# Altium schematic sheet Industrial-Controller_MCU.SchDoc: MCU
size 279 x 215 mm; Date: not used; ApprovedBy: not used; CheckedBy: not used; Author: not used; DrawnBy: not used; Organization: not used; Address4: not used; SheetNumber: 3; SheetTotal: 21; Time: not used; ImagePath: not used; Application_BuildNumber: not used
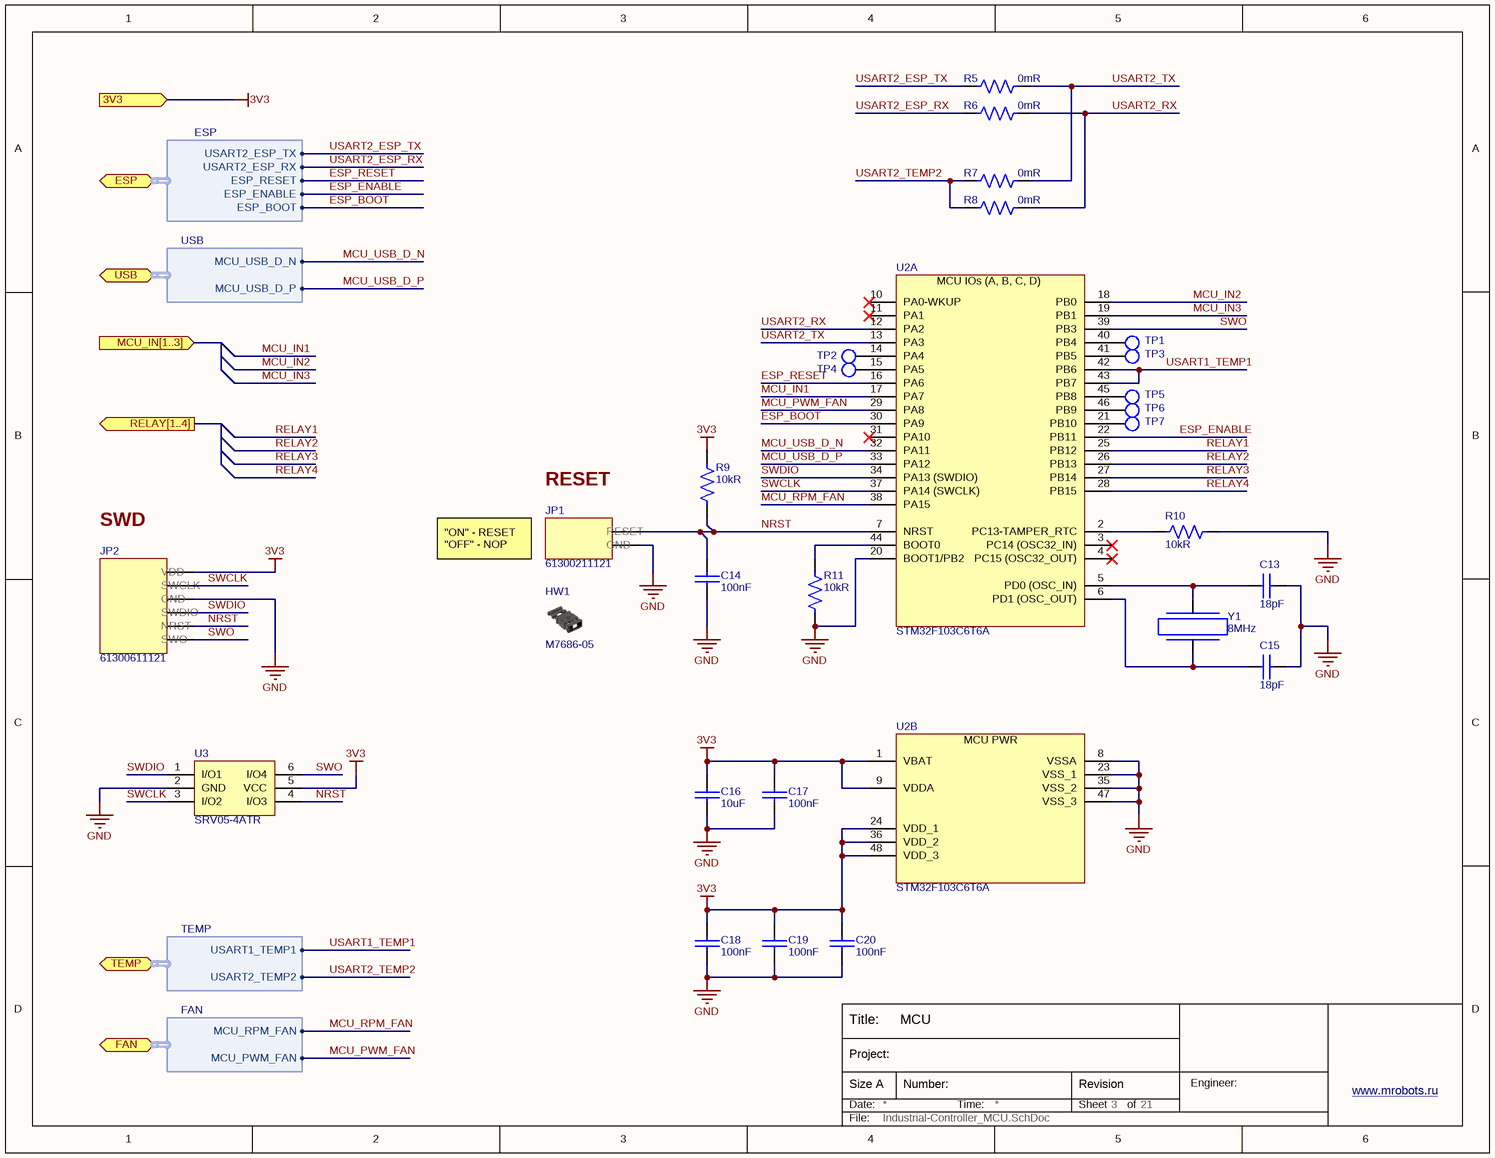
[diagram p0: Industrial-Controller_MCU.SchDoc]

## Parts
C13  18pF  [CAP_0603]
C14  100nF  [CAP_0603]
C15  18pF  [CAP_0603]
C16  10uF  [CAP_1210]
C17  100nF  [CAP_0603]
C18  100nF  [CAP_0603]
C19  100nF  [CAP_0603]
C20  100nF  [CAP_0603]
HW1  M7686-05  (mechanical)
JP1  61300211121  [PLS-2]
JP2  61300611121  [PLS-6]
R5  0mR  [RES_0603]
R6  0mR  [RES_0603]
R7  0mR  [RES_0603]
R8  0mR  [RES_0603]
R9  10kR  [RES_0603]
R10  10kR  [RES_0603]
R11  10kR  [RES_0603]
TP1  TEST_POINT_SMT  [TEST_POINT_SMT]  (value not drawn)  (no BOM)
TP2  TEST_POINT_SMT  [TEST_POINT_SMT]  (value not drawn)  (no BOM)
TP3  TEST_POINT_SMT  [TEST_POINT_SMT]  (value not drawn)  (no BOM)
TP4  TEST_POINT_SMT  [TEST_POINT_SMT]  (value not drawn)  (no BOM)
TP5  TEST_POINT_SMT  [TEST_POINT_SMT]  (value not drawn)  (no BOM)
TP6  TEST_POINT_SMT  [TEST_POINT_SMT]  (value not drawn)  (no BOM)
TP7  TEST_POINT_SMT  [TEST_POINT_SMT]  (value not drawn)  (no BOM)
U2  STM32F103C6T6A  [LQFP48]  (parts A,B of 2)
U3  SRV05-4ATR  [SOT-23-6]
Y1  8MHz  [HC-49/US]

## Ports
3V3 (in), ESP (bidir, harness ESP), FAN (bidir, harness FAN), MCU_IN[1..3] (in), RELAY[1..4] (out), TEMP (bidir, harness TEMP), USB (bidir, harness USB)

## Harnesses
ESP: USART2_ESP_TX, USART2_ESP_RX, ESP_RESET, ESP_ENABLE, ESP_BOOT
USB: MCU_USB_D_N, MCU_USB_D_P
FAN: MCU_RPM_FAN, MCU_PWM_FAN
TEMP: USART1_TEMP1, USART2_TEMP2

## Nets
3V3: C16.2 C17.1 C18.1 C19.1 C20.1 JP2.1 R9.1 U2.1(VBAT) U2.9(VDDA) U2.24(VDD_1) U2.36(VDD_2) U2.48(VDD_3) U3.5(VCC) ; port 3V3
GND: C13.2 C14.2 C15.2 C16.1 C17.2 C18.2 C19.2 C20.2 JP1.2 JP2.3 R10.1 R11.1 U2.8(VSSA) U2.20(BOOT1/PB2) U2.23(VSS_1) U2.35(VSS_2) U2.47(VSS_3) U3.2(GND)
ESP_BOOT: U2.30(PA9) ; port ESP.ESP_BOOT
ESP_ENABLE: U2.22(PB11) ; port ESP.ESP_ENABLE
ESP_RESET: U2.16(PA6) ; port ESP.ESP_RESET
MCU_IN1: U2.17(PA7)
MCU_IN2: U2.18(PB0)
MCU_IN3: U2.19(PB1)
MCU_PWM_FAN: U2.29(PA8) ; port FAN.MCU_PWM_FAN
MCU_RPM_FAN: U2.38(PA15) ; port FAN.MCU_RPM_FAN
MCU_USB_D_N: U2.32(PA11) ; port USB.MCU_USB_D_N
MCU_USB_D_P: U2.33(PA12) ; port USB.MCU_USB_D_P
NRST: C14.1 JP1.1 JP2.5 R9.2 U2.7(NRST) U3.4(I/O3)
RELAY1: U2.25(PB12)
RELAY2: U2.26(PB13)
RELAY3: U2.27(PB14)
RELAY4: U2.28(PB15)
SWCLK: JP2.2 U2.37(PA14_(SWCLK)) U3.3(I/O2)
SWDIO: JP2.4 U2.34(PA13_(SWDIO)) U3.1(I/O1)
SWO: JP2.6 U2.39(PB3) U3.6(I/O4)
USART1_TEMP1: U2.42(PB6) U2.43(PB7) ; port TEMP.USART1_TEMP1
USART2_ESP_RX: R6.1 ; port ESP.USART2_ESP_RX
USART2_ESP_TX: R5.1 ; port ESP.USART2_ESP_TX
USART2_RX: R6.2 R8.2 U2.12(PA2)
USART2_TEMP2: R7.1 R8.1 ; port TEMP.USART2_TEMP2
USART2_TX: R5.2 R7.2 U2.13(PA3)
NetC13_1: C13.1 U2.5(PD0_(OSC_IN)) Y1.2
NetC15_1: C15.1 U2.6(PD1_(OSC_OUT)) Y1.1
NetR10_2: R10.2 U2.2(PC13-TAMPER_RTC)
NetR11_2: R11.2 U2.44(BOOT0)
NetTP1_1: TP1.1 U2.40(PB4)
NetTP2_1: TP2.1 U2.14(PA4)
NetTP3_1: TP3.1 U2.41(PB5)
NetTP4_1: TP4.1 U2.15(PA5)
NetTP5_1: TP5.1 U2.45(PB8)
NetTP6_1: TP6.1 U2.46(PB9)
NetTP7_1: TP7.1 U2.21(PB10)

Not connected (* = marked no-connect by the designer): U2 3(PC14_(OSC32_IN))* 4(PC15_(OSC32_OUT))* 10(PA0-WKUP)* 11(PA1)* 31(PA10)*

## Notes on the sheet
- (near JP1) RESET
- SWD
- (near HW1) "ON" - RESET
  "OFF" - NOP
- Title:
- Date:
- Size A
- Project:
- Number:
- Time:
- Sheet
- Revision
- of
- Engineer:
- www.mrobots.ru <http://mrobots.ru/>
- File:
- (in symbol STM32F103C6T6A, part A) MCU IOs (A, B, C, D)
- (in symbol STM32F103C6T6A, part B) MCU PWR

## Library data of the parts
C13 C15 = C0603C180J5GACAUTO: CAP CER 18PF 50V C0G/NP0 0603; Manufacturer: KEMET; Dielectric Material: Ceramic; Tolerance: 5%; Dielectric: C0G; Supplier 1: Arrow Electronics; Manufacturer Part Number: C0603C180J5GACAUTO; RoHS: Yes; Category: Ceramic Capacitors; Stock 1: 13801; Pricing 1: 1=0.10780, 10=0.04490, 25=0.04440, 100=0.03270, 250=0.03140, 500=0.02510, 1000=0.01950, 3000=0.01910, 6000=0.01510 (USD); Case/Package: 0603; Min Operating Temperature: -55°C; Max Operating Temperature: 125°C; Packaging: Tape and Reel; Capacitance: 18pF; Voltage Rating (DC): 50V; Length: 1.6mm; Depth: 0.8mm; Lead Free: Lead Free; RoHS Compliant: Yes; ComponentLink1URL: http://www.farnell.com/datasheets/2747367.pdf?src-supplier=Farnell; ComponentLink1Description: http://www.farnell.com/datasheets/2747367.pdf?src-supplier=Farnell; ComponentLink2URL: https://api.kemet.com/component-edge/download/datasheet/C0603C180J5GACAUTO.pdf?src-supplier=Digi-Key; ComponentLink2Description: https://api.kemet.com/component-edge/download/datasheet/C0603C180J5GACAUTO.pdf?src-supplier=Digi-Key; ComponentLink3URL: http://www.farnell.com/datasheets/2747367.pdf?src-supplier=Newark; ComponentLink3Description: http://www.farnell.com/datasheets/2747367.pdf?src-supplier=Newark; ComponentLink4URL: http://www.farnell.com/datasheets/2747367.pdf?src-supplier=Element14; ComponentLink4Description: http://www.farnell.com/datasheets/2747367.pdf?src-supplier=Element14; Supplier Part Number 1: C0603C180J5GACAUTO; Manufacturer 1: KEMET; Manufacturer Part Number 1: C0603C180J5GACAUTO
C14 C17-C20 = CL10B104KB8NNNL: CAP CER 0.1UF 50V X7R 0603; Manufacturer 1: Samsung; Tolerance: 10%; Supplier 1: Digi-Key; Manufacturer Part Number 1: CL10B104KB8NNNL; RoHS: Yes; Category: Ceramic Capacitors; Stock 1: 2348404; Pricing 1: 15000=0,00532, 30000=0,00506 (USD); Mount: Surface Mount; Case/Package: 0603; Min Operating Temperature: -55°C; Max Operating Temperature: 125°C; Capacitance: 100nF; Packaging: Tape and Reel; Package Quantity: 15000; Voltage Rating: 50V; Dielectric: X7R; Voltage Rating (DC): 50V; Series: CL; Construction: Flat; Length: 1.6mm; Width: 0.031inch; Height: 0.8mm; Thickness: 0.035inch; Depth: 0.8mm; Radiation Hardening: No; RoHS Compliant: Yes; ComponentLink1URL: https://datasheet.ciiva.com/26838/getdatasheetpartid-357523-26838415.pdf?src-supplier=Verical; ComponentLink1Description: https://datasheet.ciiva.com/26838/getdatasheetpartid-357523-26838415.pdf?src-supplier=Verical; ComponentLink2URL: https://datasheet.ciiva.com/25741/cl10b104kb8nnnl-25741341.pdf?src-supplier=Digi-Key; ComponentLink2Description: https://datasheet.ciiva.com/25741/cl10b104kb8nnnl-25741341.pdf?src-supplier=Digi-Key; Supplier Part Number 1: 1276-CL10B104KB8NNNLTR-ND
C16 = CL32B106KBJNNWE: CAP CER 10UF 50V X7R 1210; Manufacturer 1: Samsung; Tolerance: 10%; Supplier 1: Digi-Key; Manufacturer Part Number 1: CL32B106KBJNNWE; RoHS: Yes; Category: Ceramic Capacitors; Stock 1: 395336; Pricing 1: 1=0,64000, 10=0,45500, 50=0,34380, 100=0,29940, 500=0,22176 (USD); Mount: Surface Mount; Case/Package: 1210; Case Code (Imperial): 1210; Case Code (Metric): 3225; Min Operating Temperature: -55°C; Max Operating Temperature: 125°C; Dielectric: X7R; Capacitance: 10uF; Voltage Rating: 50V; Package Quantity: 1; Packaging: Tape and Reel; Length: 0.126inch; Width: 0.098inch; Thickness: 0.106inch; Lead Free: Lead Free; ComponentLink1URL: https://datasheet.ciiva.com/25721/cl32b106kbjnnwe-25721651.pdf?src-supplier=Digi-Key; ComponentLink1Description: https://datasheet.ciiva.com/25721/cl32b106kbjnnwe-25721651.pdf?src-supplier=Digi-Key; Supplier Part Number 1: 1276-3388-1-ND
HW1 = M7686-05: CLOSED TOP JUMPER SOCKET; Manufacturer 1: Harwin; Plating: Gold; Number of Contacts: 2; Contact Resistance: 25mR; Current Rating: 3A; Mating Cycles: 300; Voltage Rating (AC): 250V; Gender: Receptacle; Insulation Resistance: 1GR; Pitch: 2.54mm; Body Length: 10mm; Supplier 1: Digi-Key; Manufacturer Part Number 1: M7686-05; RoHS: Yes; Category: Terminal Blocks; Stock 1: 26597; Pricing 1: 1=0,40000, 10=0,34400, 25=0,30280, 50=0,27820, 100=0,26720, 250=0,23996, 500=0,22906, 1000=0,19089, 2500=0,17453 (USD); Housing Color: Black; Contact Material: Bronze; Contact Plating: Gold; Color: Black; Material: Polyester; Weight: 0.0625lb; Housing Material: Polyester; Min Operating Temperature: -40°C; Max Operating Temperature: 85°C; Number of Rows: 1; Voltage Rating (DC): 250V; Contact Gender: Female; Package Quantity: 2500; Voltage Rating: 250V; Max Current Rating: 3A; Number of Positions: 2; Packaging: Bulk; Max Voltage Rating (AC): 250V; Orientation: Straight; Series: M76; Length: 10mm; Width: 5mm; Height: 0.394inch; Lead Pitch: 2.54mm; Depth: 2.4mm; Radiation Hardening: No; REACH SVHC: No SVHC; Flammability Rating: UL94 V-0; RoHS Compliant: Yes; ComponentLink1URL: https://datasheet.ciiva.com/11754/0900766b81034e4c-11754957.pdf?src-supplier=RSComponents; ComponentLink1Description: https://datasheet.ciiva.com/11754/0900766b81034e4c-11754957.pdf?src-supplier=RSComponents; ComponentLink2URL: https://datasheet.ciiva.com/6781/m7684-m7687-6781583.pdf?src-supplier=Digi-Key; ComponentLink2Description: https://datasheet.ciiva.com/6781/m7684-m7687-6781583.pdf?src-supplier=Digi-Key; Supplier Part Number 1: 952-2023-ND
JP1 = 61300211121: CONN HEADER VERT 2POS 2.54MM; Manufacturer 1: Wurth Electronics; Current Rating: 3A; Voltage Rating: 250V; Number of Positions: 2; Gender: Male; Connector Type: Male Pin; Pitch: 0.1inch; Contact_1: RESET; Contact_2: GND; Supplier 1: Digi-Key; RoHS: Yes; Category: Headers and Wire Housings; Pricing 1: 1=0.13000, 10=0.11000, 25=0.09120, 50=0.07700, 100=0.06900, 1000=0.06300 (USD); Mount: Through Hole; Contact Plating: Gold; Housing Material: PBT; Contact Material: Copper Alloy,Copper; Color: Black; Min Operating Temperature: -40°C; Max Operating Temperature: 125°C; Number of Rows: 1; Contact Gender: Male; Packaging: Bulk; Termination: Through Hole; Number of Contacts: 2; Series: WR-PHD; Contact Type: Male Pin; Contact Mating Length: 0.236inch; REACH SVHC: Unknown; Lead Free: Lead Free; RoHS Compliant: Yes; ComponentLink1URL: https://datasheet.ciiva.com/13619/6130xx11121-48870-13619345.pdf?src-supplier=Mouser; ComponentLink1Description: https://datasheet.ciiva.com/13619/6130xx11121-48870-13619345.pdf?src-supplier=Mouser; Supplier Part Number 1: 732-5315-ND; Manufacturer Part Number 1: 61300211121
JP2 = 61300611121: CONN HEADER VERT 6POS 2.54MM; Manufacturer 1: Wurth Electronics; Current Rating: 3A; Voltage Rating: 250V; Number of Positions: 6; Gender: Male; Connector Type: Male Pin; Pitch: 0.1inch; Contact_1: VDD; Contact_2: SWCLK; Contact_3: GND; Contact_4: SWDIO; Contact_5: NRST; Contact_6: SWO; Supplier 1: Digi-Key; RoHS: Yes; Category: Headers and Wire Housings; Stock 1: 8041; Pricing 1: 1=0.34000, 10=0.28900, 25=0.24000, 50=0.20100, 100=0.18200, 1000=0.16600 (USD); Mount: Through Hole; Contact Plating: Gold; Contact Material: Copper Alloy,Copper; Housing Material: PBT; Color: Black; Min Operating Temperature: -40°C; Max Operating Temperature: 125°C; Number of Rows: 1; Contact Gender: Male; Packaging: Bulk; Termination: Through Hole; Number of Contacts: 6; Series: WR-PHD; Contact Type: Male Pin; Contact Mating Length: 0.236inch; REACH SVHC: Unknown; Lead Free: Lead Free; RoHS Compliant: Yes; ComponentLink1URL: http://www.mouser.com/ds/2/445/6130xx11121-538006.pdf?src-supplier=Mouser; ComponentLink1Description: http://www.mouser.com/ds/2/445/6130xx11121-538006.pdf?src-supplier=Mouser; ComponentLink2URL: http://www.farnell.com/cad/1737268.pdf?src-supplier=Element14; ComponentLink2Description: http://www.farnell.com/cad/1737268.pdf?src-supplier=Element14; ComponentLink3URL: https://katalog.we-online.de/em/datasheet/6130xx11121.pdf?src-supplier=Digi-Key; ComponentLink3Description: https://katalog.we-online.de/em/datasheet/6130xx11121.pdf?src-supplier=Digi-Key; Supplier Part Number 1: 732-5319-ND; Manufacturer Part Number 1: 61300611121
R5-R8 = RC0603FR-070RL: RES 0 OHM JUMPER 1/10W 0603; Manufacturer 1: Yageo; Power Rating: 100mW; Tolerance: 1%; Voltage Rating (DC): 50V; Temperature Coefficient: 200ppm/°C; Current Rating: 1A; Working Voltage: 75V; Supplier 1: Arrow Electronics; RoHS: Yes; Category: Chip SMD Resistors; Stock 1: 2434418; Pricing 1: 5000=0,00220 (USD); Case/Package: 0603; Number of Pins: 2; Contact Plating: Tin,Matte; Case Code (Metric): 1608; Case Code (Imperial): 0603; Min Operating Temperature: -55°C; Max Operating Temperature: 155°C; Resistance: 0mR; Packaging: Tape and Reel; Resistor Type: Thick Film; Package Quantity: 5000; Voltage Rating: 50V; Number of Terminations: 2; Termination: SMD/SMT; Max Power Dissipation: 100mW; Features: Moisture Resistant; Series: RC; Construction: Rectangular; Resistance Tolerance: 1%; Technology: THICK FILM; Length: 1.6mm; Width: 0.031inch; Height: 0.45mm; Depth: 0.8mm; Radiation Hardening: No; REACH SVHC: No SVHC; Lead Free: Lead Free; RoHS Compliant: Yes; Military Standard: Not; ComponentLink1URL: https://datasheet.ciiva.com/11808/0900766b80f96399-11808172.pdf?src-supplier=RSComponents; ComponentLink1Description: https://datasheet.ciiva.com/11808/0900766b80f96399-11808172.pdf?src-supplier=RSComponents; ComponentLink2URL: https://datasheet.ciiva.com/5684/443971-5684699.pdf?src-supplier=Farnell; ComponentLink2Description: https://datasheet.ciiva.com/5684/443971-5684699.pdf?src-supplier=Farnell; ComponentLink3URL: https://datasheet.ciiva.com/7983/443971-7983627.pdf?src-supplier=Element14; ComponentLink3Description: https://datasheet.ciiva.com/7983/443971-7983627.pdf?src-supplier=Element14; ComponentLink4URL: https://datasheet.ciiva.com/22643/1868787-22643388.pdf?src-supplier=Element14; ComponentLink4Description: https://datasheet.ciiva.com/22643/1868787-22643388.pdf?src-supplier=Element14; ComponentLink5URL: https://datasheet.ciiva.com/46382/443971-46382072.pdf?src-supplier=Element14; ComponentLink5Description: https://datasheet.ciiva.com/46382/443971-46382072.pdf?src-supplier=Element14; ComponentLink6URL: https://datasheet.ciiva.com/29721/pyu-r-int-thick-7-29721178.pdf?src-supplier=Digi-Key; ComponentLink6Description: https://datasheet.ciiva.com/29721/pyu-r-int-thick-7-29721178.pdf?src-supplier=Digi-Key; ComponentLink7URL: https://datasheet.ciiva.com/29721/pyu-rc0603-51-rohs-l-4-29721179.pdf?src-supplier=Digi-Key; ComponentLink7Description: https://datasheet.ciiva.com/29721/pyu-rc0603-51-rohs-l-4-29721179.pdf?src-supplier=Digi-Key; ComponentLink8URL: https://datasheet.ciiva.com/5558/rc0603-272842-5558341.pdf?src-supplier=Mouser; ComponentLink8Description: https://datasheet.ciiva.com/5558/rc0603-272842-5558341.pdf?src-supplier=Mouser; Supplier Part Number 1: RC0603FR-070RL; Manufacturer Part Number 1: RC0603FR-070RL
R9-R11 = RC0603FR-0710KL: RES 10K OHM 1% 1/10W 0603; Manufacturer 1: Yageo; Voltage Rating (DC): 50V; Temperature Coefficient: 100ppm/°C; Power Rating: 100mW; Voltage Rating: 75V; Supplier 1: Arrow Electronics; RoHS: Yes; Category: Chip SMD Resistors; Stock 1: 4950000; Pricing 1: 5000=0,00240 (USD); Case/Package: 0603; Number of Pins: 2; Case Code (Imperial): 0603; Case Code (Metric): 1608; Weight: 7.1E-05oz; Size Code: 0603; Min Operating Temperature: -55°C; Max Operating Temperature: 155°C; Packaging: Tape and Reel; Resistance: 10kR; Tolerance: 1%; Resistor Type: Thick Film; Termination: SMD/SMT; Features: Moisture Resistant; Series: RC; Max Power Dissipation: 100mW; Number of Terminations: 2; Resistance Tolerance: 1%; Construction: Rectangular; Length: 1.6mm; Width: 0.8mm; Height: 0.45mm; Depth: 0.8mm; Lead Pitch: 0.3mm; REACH SVHC: Unknown; Lead Free: Lead Free; Military Standard: Not; RoHS Compliant: Yes; ComponentLink1URL: https://datasheet.ciiva.com/7660/38590-7660789.pdf?src-supplier=Element14; ComponentLink1Description: https://datasheet.ciiva.com/7660/38590-7660789.pdf?src-supplier=Element14; ComponentLink2URL: https://datasheet.ciiva.com/7983/443971-7983596.pdf?src-supplier=Element14; ComponentLink2Description: https://datasheet.ciiva.com/7983/443971-7983596.pdf?src-supplier=Element14; ComponentLink3URL: https://datasheet.ciiva.com/22747/443971-22747519.pdf?src-supplier=Element14; ComponentLink3Description: https://datasheet.ciiva.com/22747/443971-22747519.pdf?src-supplier=Element14; ComponentLink4URL: https://datasheet.ciiva.com/46440/1868787-46440891.pdf?src-supplier=Element14; ComponentLink4Description: https://datasheet.ciiva.com/46440/1868787-46440891.pdf?src-supplier=Element14; ComponentLink5URL: https://datasheet.ciiva.com/7746/1738695-7746239.pdf?src-supplier=Element14; ComponentLink5Description: https://datasheet.ciiva.com/7746/1738695-7746239.pdf?src-supplier=Element14; Supplier Part Number 1: RC0603FR-0710KL; Manufacturer Part Number 1: RC0603FR-0710KL
TP1-TP7 = TEST_POINT_SMT: STM TEST POINT
U2 = STM32F103C6T6A: IC MCU 32BIT 32KB FLASH 48LQFP; Manufacturer 1: STMicroelectronics; Number of Timers/Counters: 3; Max Supply Voltage: 3.6V; Frequency: 72MHz; Interface: I2C,SPI,USART; RAM Size: 10KB; Max Power Dissipation: 363mW; Number of I/Os: 37; Min Supply Voltage: 2V; Oscillator Type: Internal; Data Bus Width: 32b; Watchdog Timer: Yes; Peripherals: POR,PWM,WDT,DMA,Temp Sensor,I2C; Core Architecture: ARM; Number of ADC Channels: 10; Number of SPI Channels: 1; Supplier 1: Newark; RoHS: Yes; Category: Microcontrollers; Pricing 1: 1=6,56000, 10=5,90000, 1500=5,90000 (USD); Case/Package: LQFP; Number of Pins: 48; Weight: 0.006409oz; Min Operating Temperature: -40°C; Max Operating Temperature: 85°C; Package Quantity: 1500; Packaging: Tray; Max Frequency: 72MHz; Number of Programmable I/O: 37; Memory Type: FLASH; Memory Size: 32KB; Series: STM32F103C6; Number of I2C Channels: 1; Address Bus Width: 32b; Length: 7mm; Width: 7mm; Height: 1.4mm; Radiation Hardening: No; Lead Free: Lead Free; REACH SVHC: No SVHC; RoHS Compliant: Yes; ComponentLink1URL: https://datasheet.ciiva.com/15122/getdatasheetpartid-69879-15122075.pdf?src-supplier=Verical; ComponentLink1Description: https://datasheet.ciiva.com/15122/getdatasheetpartid-69879-15122075.pdf?src-supplier=Verical; ComponentLink2URL: https://datasheet.ciiva.com/14100/pustm-arm-microcont-stm32f103-en-14100507.pdf?src-supplier=Distrelec; ComponentLink2Description: https://datasheet.ciiva.com/14100/pustm-arm-microcont-stm32f103-en-14100507.pdf?src-supplier=Distrelec; Supplier Part Number 1: 57P1219; Manufacturer Part Number 1: STM32F103C6T6A
U3 = SRV05-4ATR: TVS DIODE 5VWM 17.5VC SOT23-6; Manufacturer 1: Sangdest Microelectronics; Supplier 1: Digi-Key; Manufacturer Part Number 1: SRV05-4ATR; RoHS: No; Category: TVS Diodes; Stock 1: 31500; Pricing 1: 1=0,45000, 10=0,36700, 100=0,24990, 500=0,18744, 1000=0,14058 (USD); Supplier Part Number 1: 1655-1653-1-ND
Y1 = ATS080B-E: CRYSTAL 8.0000MHZ 18PF TH; Manufacturer 1: CTS; Frequency Tolerance: 30ppm; ESR (Equivalent Series Resistance): 60R; Frequency Stability: 50ppm; Supplier 1: Avnet; RoHS: Yes; Category: Crystals; Stock 1: 4510; Pricing 1: 1000=0.18120, 1200=0.17880, 2200=0.17040, 5000=0.13800, 10000=0.12150, 50000=0.10956, 100000=0.10707 (USD); Mount: Through Hole; Number of Pins: 2; Contact Plating: Copper,Tin,Silver; Min Operating Temperature: -40°C; Max Operating Temperature: 85°C; Package Quantity: 100; Frequency: 8MHz; Load Capacitance: 18pF; Packaging: Bulk; Tolerance: 30ppm; Termination: Radial; Series: ATS; Length: 0.427inch; Width: 0.177inch; Height: 0.145inch; RoHS Compliant: Yes; ComponentLink1URL: https://datasheet.ciiva.com/859/008-0309-0-859649.pdf?src-supplier=Digi-Key; ComponentLink1Description: https://datasheet.ciiva.com/859/008-0309-0-859649.pdf?src-supplier=Digi-Key; ComponentLink2URL: https://datasheet.ciiva.com/3176/008-0309-0-3176342.pdf?src-supplier=Avnet; ComponentLink2Description: https://datasheet.ciiva.com/3176/008-0309-0-3176342.pdf?src-supplier=Avnet; ComponentLink3URL: https://datasheet.ciiva.com/4945/008-0309-0-32667-4945355.pdf?src-supplier=Mouser; ComponentLink3Description: https://datasheet.ciiva.com/4945/008-0309-0-32667-4945355.pdf?src-supplier=Mouser; Supplier Part Number 1: ATS080B-E; Manufacturer Part Number 1: ATS080B-E